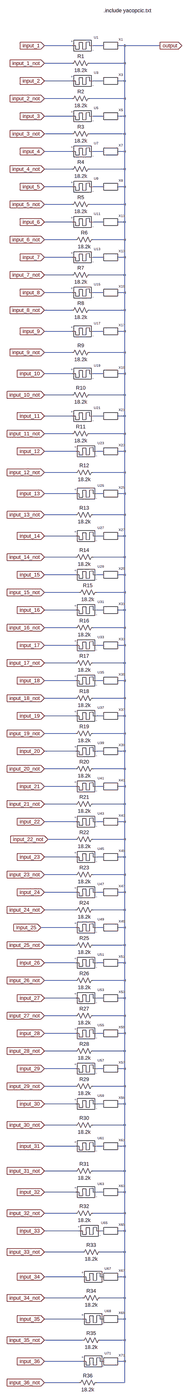
[diagram p0: schematic memristor_block.asc, whole sheet]
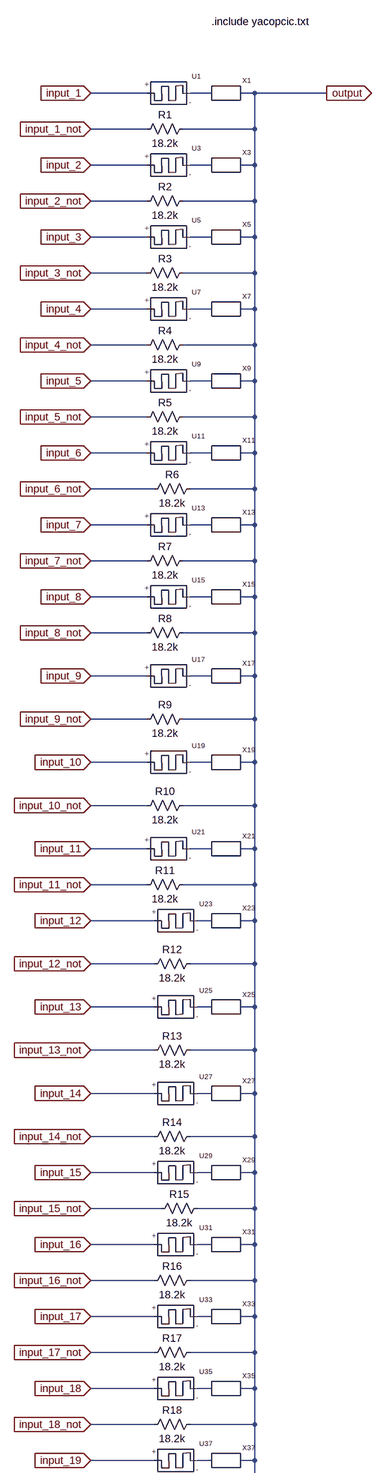
[diagram p1: schematic memristor_block.asc, part, row 1 of 2, column 1 of 1]
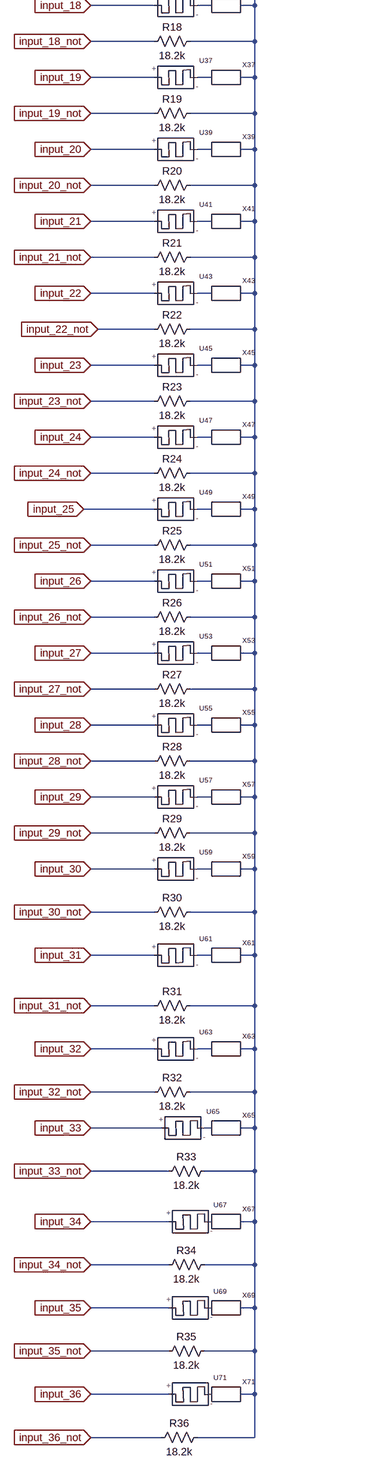
[diagram p2: schematic memristor_block.asc, part, row 2 of 2, column 1 of 1]
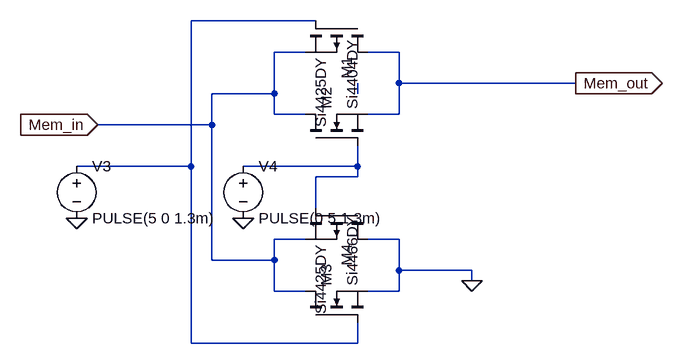
[diagram p3: sub-circuit programmer_with_transmission.asc]
memristor_block.asc, the LTspice schematic file:
Version 4
SHEET 1 880 1512
WIRE -2736 -5216 -2928 -5216
WIRE -2592 -5216 -2640 -5216
WIRE -2496 -5216 -2528 -5216
WIRE -2336 -5216 -2496 -5216
WIRE -2736 -5136 -2928 -5136
WIRE -2496 -5136 -2496 -5216
WIRE -2496 -5136 -2656 -5136
WIRE -2736 -5056 -2928 -5056
WIRE -2592 -5056 -2640 -5056
WIRE -2496 -5056 -2496 -5136
WIRE -2496 -5056 -2528 -5056
WIRE -2736 -4976 -2928 -4976
WIRE -2496 -4976 -2496 -5056
WIRE -2496 -4976 -2656 -4976
WIRE -2736 -4896 -2928 -4896
WIRE -2592 -4896 -2640 -4896
WIRE -2496 -4896 -2496 -4976
WIRE -2496 -4896 -2528 -4896
WIRE -2736 -4816 -2928 -4816
WIRE -2496 -4816 -2496 -4896
WIRE -2496 -4816 -2656 -4816
WIRE -2736 -4736 -2928 -4736
WIRE -2592 -4736 -2640 -4736
WIRE -2496 -4736 -2496 -4816
WIRE -2496 -4736 -2528 -4736
WIRE -2736 -4656 -2928 -4656
WIRE -2496 -4656 -2496 -4736
WIRE -2496 -4656 -2656 -4656
WIRE -2736 -4576 -2928 -4576
WIRE -2592 -4576 -2640 -4576
WIRE -2496 -4576 -2496 -4656
WIRE -2496 -4576 -2528 -4576
WIRE -2736 -4496 -2928 -4496
WIRE -2496 -4496 -2496 -4576
WIRE -2496 -4496 -2656 -4496
WIRE -2736 -4416 -2928 -4416
WIRE -2592 -4416 -2640 -4416
WIRE -2496 -4416 -2496 -4496
WIRE -2496 -4416 -2528 -4416
WIRE -2720 -4336 -2928 -4336
WIRE -2496 -4336 -2496 -4416
WIRE -2496 -4336 -2640 -4336
WIRE -2736 -4256 -2928 -4256
WIRE -2592 -4256 -2640 -4256
WIRE -2496 -4256 -2496 -4336
WIRE -2496 -4256 -2528 -4256
WIRE -2736 -4176 -2928 -4176
WIRE -2496 -4176 -2496 -4256
WIRE -2496 -4176 -2656 -4176
WIRE -2736 -4096 -2928 -4096
WIRE -2592 -4096 -2640 -4096
WIRE -2496 -4096 -2496 -4176
WIRE -2496 -4096 -2528 -4096
WIRE -2736 -4016 -2928 -4016
WIRE -2496 -4016 -2496 -4096
WIRE -2496 -4016 -2656 -4016
WIRE -2736 -3920 -2928 -3920
WIRE -2592 -3920 -2640 -3920
WIRE -2496 -3920 -2496 -4016
WIRE -2496 -3920 -2528 -3920
WIRE -2736 -3824 -2928 -3824
WIRE -2496 -3824 -2496 -3920
WIRE -2496 -3824 -2656 -3824
WIRE -2736 -3728 -2928 -3728
WIRE -2592 -3728 -2640 -3728
WIRE -2496 -3728 -2496 -3824
WIRE -2496 -3728 -2528 -3728
WIRE -2736 -3632 -2928 -3632
WIRE -2496 -3632 -2496 -3728
WIRE -2496 -3632 -2656 -3632
WIRE -2736 -3536 -2928 -3536
WIRE -2592 -3536 -2640 -3536
WIRE -2496 -3536 -2496 -3632
WIRE -2496 -3536 -2528 -3536
WIRE -2736 -3456 -2928 -3456
WIRE -2496 -3456 -2496 -3536
WIRE -2496 -3456 -2656 -3456
WIRE -2720 -3376 -2928 -3376
WIRE -2592 -3376 -2624 -3376
WIRE -2496 -3376 -2496 -3456
WIRE -2496 -3376 -2528 -3376
WIRE -2720 -3280 -2928 -3280
WIRE -2496 -3280 -2496 -3376
WIRE -2496 -3280 -2640 -3280
WIRE -2720 -3184 -2928 -3184
WIRE -2592 -3184 -2624 -3184
WIRE -2496 -3184 -2496 -3280
WIRE -2496 -3184 -2528 -3184
WIRE -2720 -3088 -2928 -3088
WIRE -2496 -3088 -2496 -3184
WIRE -2496 -3088 -2640 -3088
WIRE -2720 -2992 -2928 -2992
WIRE -2592 -2992 -2624 -2992
WIRE -2496 -2992 -2496 -3088
WIRE -2496 -2992 -2528 -2992
WIRE -2720 -2896 -2928 -2896
WIRE -2496 -2896 -2496 -2992
WIRE -2496 -2896 -2640 -2896
WIRE -2720 -2816 -2928 -2816
WIRE -2592 -2816 -2624 -2816
WIRE -2496 -2816 -2496 -2896
WIRE -2496 -2816 -2528 -2816
WIRE -2704 -2736 -2928 -2736
WIRE -2496 -2736 -2496 -2816
WIRE -2496 -2736 -2624 -2736
WIRE -2720 -2656 -2928 -2656
WIRE -2592 -2656 -2624 -2656
WIRE -2496 -2656 -2496 -2736
WIRE -2496 -2656 -2528 -2656
WIRE -2720 -2576 -2928 -2576
WIRE -2496 -2576 -2496 -2656
WIRE -2496 -2576 -2640 -2576
WIRE -2720 -2496 -2928 -2496
WIRE -2592 -2496 -2624 -2496
WIRE -2496 -2496 -2496 -2576
WIRE -2496 -2496 -2528 -2496
WIRE -2720 -2416 -2928 -2416
WIRE -2496 -2416 -2496 -2496
WIRE -2496 -2416 -2640 -2416
WIRE -2720 -2336 -2928 -2336
WIRE -2592 -2336 -2624 -2336
WIRE -2496 -2336 -2496 -2416
WIRE -2496 -2336 -2528 -2336
WIRE -2720 -2256 -2928 -2256
WIRE -2496 -2256 -2496 -2336
WIRE -2496 -2256 -2640 -2256
WIRE -2720 -2176 -2928 -2176
WIRE -2592 -2176 -2624 -2176
WIRE -2496 -2176 -2496 -2256
WIRE -2496 -2176 -2528 -2176
WIRE -2720 -2096 -2928 -2096
WIRE -2496 -2096 -2496 -2176
WIRE -2496 -2096 -2640 -2096
WIRE -2720 -2016 -2928 -2016
WIRE -2592 -2016 -2624 -2016
WIRE -2496 -2016 -2496 -2096
WIRE -2496 -2016 -2528 -2016
WIRE -2720 -1936 -2928 -1936
WIRE -2496 -1936 -2496 -2016
WIRE -2496 -1936 -2640 -1936
WIRE -2720 -1856 -2928 -1856
WIRE -2592 -1856 -2624 -1856
WIRE -2496 -1856 -2496 -1936
WIRE -2496 -1856 -2528 -1856
WIRE -2720 -1776 -2928 -1776
WIRE -2496 -1776 -2496 -1856
WIRE -2496 -1776 -2640 -1776
WIRE -2720 -1696 -2928 -1696
WIRE -2592 -1696 -2624 -1696
WIRE -2496 -1696 -2496 -1776
WIRE -2496 -1696 -2528 -1696
WIRE -2720 -1616 -2912 -1616
WIRE -2496 -1616 -2496 -1696
WIRE -2496 -1616 -2640 -1616
WIRE -2720 -1536 -2928 -1536
WIRE -2592 -1536 -2624 -1536
WIRE -2496 -1536 -2496 -1616
WIRE -2496 -1536 -2528 -1536
WIRE -2720 -1456 -2928 -1456
WIRE -2496 -1456 -2496 -1536
WIRE -2496 -1456 -2640 -1456
WIRE -2720 -1376 -2928 -1376
WIRE -2592 -1376 -2624 -1376
WIRE -2496 -1376 -2496 -1456
WIRE -2496 -1376 -2528 -1376
WIRE -2720 -1296 -2928 -1296
WIRE -2496 -1296 -2496 -1376
WIRE -2496 -1296 -2640 -1296
WIRE -2720 -1216 -2944 -1216
WIRE -2592 -1216 -2624 -1216
WIRE -2496 -1216 -2496 -1296
WIRE -2496 -1216 -2528 -1216
WIRE -2720 -1136 -2928 -1136
WIRE -2496 -1136 -2496 -1216
WIRE -2496 -1136 -2640 -1136
WIRE -2720 -1056 -2928 -1056
WIRE -2592 -1056 -2624 -1056
WIRE -2496 -1056 -2496 -1136
WIRE -2496 -1056 -2528 -1056
WIRE -2720 -976 -2928 -976
WIRE -2496 -976 -2496 -1056
WIRE -2496 -976 -2640 -976
WIRE -2720 -896 -2928 -896
WIRE -2592 -896 -2624 -896
WIRE -2496 -896 -2496 -976
WIRE -2496 -896 -2528 -896
WIRE -2720 -816 -2928 -816
WIRE -2496 -816 -2496 -896
WIRE -2496 -816 -2640 -816
WIRE -2720 -736 -2928 -736
WIRE -2592 -736 -2624 -736
WIRE -2496 -736 -2496 -816
WIRE -2496 -736 -2528 -736
WIRE -2720 -656 -2928 -656
WIRE -2496 -656 -2496 -736
WIRE -2496 -656 -2640 -656
WIRE -2720 -576 -2928 -576
WIRE -2592 -576 -2624 -576
WIRE -2496 -576 -2496 -656
WIRE -2496 -576 -2528 -576
WIRE -2720 -496 -2928 -496
WIRE -2496 -496 -2496 -576
WIRE -2496 -496 -2640 -496
WIRE -2720 -416 -2928 -416
WIRE -2592 -416 -2624 -416
WIRE -2496 -416 -2496 -496
WIRE -2496 -416 -2528 -416
WIRE -2720 -320 -2928 -320
WIRE -2496 -320 -2496 -416
WIRE -2496 -320 -2640 -320
WIRE -2720 -224 -2928 -224
WIRE -2592 -224 -2624 -224
WIRE -2496 -224 -2496 -320
WIRE -2496 -224 -2528 -224
WIRE -2720 -112 -2928 -112
WIRE -2496 -112 -2496 -224
WIRE -2496 -112 -2640 -112
WIRE -2720 -16 -2928 -16
WIRE -2592 -16 -2624 -16
WIRE -2496 -16 -2496 -112
WIRE -2496 -16 -2528 -16
WIRE -2720 80 -2928 80
WIRE -2496 80 -2496 -16
WIRE -2496 80 -2640 80
WIRE -2704 160 -2928 160
WIRE -2592 160 -2608 160
WIRE -2496 160 -2496 80
WIRE -2496 160 -2528 160
WIRE -2688 256 -2928 256
WIRE -2496 256 -2496 160
WIRE -2496 256 -2608 256
WIRE -2688 368 -2928 368
WIRE -2496 368 -2496 256
WIRE -2496 368 -2528 368
WIRE -2688 464 -2928 464
WIRE -2496 464 -2496 368
WIRE -2496 464 -2608 464
WIRE -2688 560 -2928 560
WIRE -2496 560 -2496 464
WIRE -2496 560 -2528 560
WIRE -2688 656 -2928 656
WIRE -2496 656 -2496 560
WIRE -2496 656 -2608 656
WIRE -2688 752 -2928 752
WIRE -2496 752 -2496 656
WIRE -2496 752 -2528 752
WIRE -2704 848 -2928 848
WIRE -2496 848 -2496 752
WIRE -2496 848 -2624 848
FLAG -2928 -5216 input_1
IOPIN -2928 -5216 In
FLAG -2928 -5136 input_1_not
IOPIN -2928 -5136 In
FLAG -2928 -5056 input_2
IOPIN -2928 -5056 In
FLAG -2928 -4976 input_2_not
IOPIN -2928 -4976 In
FLAG -2928 -4896 input_3
IOPIN -2928 -4896 In
FLAG -2928 -4816 input_3_not
IOPIN -2928 -4816 In
FLAG -2928 -4736 input_4
IOPIN -2928 -4736 In
FLAG -2928 -4656 input_4_not
IOPIN -2928 -4656 In
FLAG -2928 -4576 input_5
IOPIN -2928 -4576 In
FLAG -2928 -4496 input_5_not
IOPIN -2928 -4496 In
FLAG -2928 -4416 input_6
IOPIN -2928 -4416 In
FLAG -2928 -4336 input_6_not
IOPIN -2928 -4336 In
FLAG -2928 -4256 input_7
IOPIN -2928 -4256 In
FLAG -2928 -4176 input_7_not
IOPIN -2928 -4176 In
FLAG -2928 -4096 input_8
IOPIN -2928 -4096 In
FLAG -2928 -4016 input_8_not
IOPIN -2928 -4016 In
FLAG -2336 -5216 output
IOPIN -2336 -5216 Out
FLAG -2928 -3920 input_9
IOPIN -2928 -3920 In
FLAG -2928 -3824 input_9_not
IOPIN -2928 -3824 In
FLAG -2928 -3728 input_10
IOPIN -2928 -3728 In
FLAG -2928 -3632 input_10_not
IOPIN -2928 -3632 In
FLAG -2928 -3536 input_11
IOPIN -2928 -3536 In
FLAG -2928 -3456 input_11_not
IOPIN -2928 -3456 In
FLAG -2928 -3376 input_12
IOPIN -2928 -3376 In
FLAG -2928 -3280 input_12_not
IOPIN -2928 -3280 In
FLAG -2928 -3184 input_13
IOPIN -2928 -3184 In
FLAG -2928 -3088 input_13_not
IOPIN -2928 -3088 In
FLAG -2928 -2992 input_14
IOPIN -2928 -2992 In
FLAG -2928 -2896 input_14_not
IOPIN -2928 -2896 In
FLAG -2928 -2816 input_15
IOPIN -2928 -2816 In
FLAG -2928 -2736 input_15_not
IOPIN -2928 -2736 In
FLAG -2928 -2656 input_16
IOPIN -2928 -2656 In
FLAG -2928 -2576 input_16_not
IOPIN -2928 -2576 In
FLAG -2928 -2496 input_17
IOPIN -2928 -2496 In
FLAG -2928 -2416 input_17_not
IOPIN -2928 -2416 In
FLAG -2928 -2336 input_18
IOPIN -2928 -2336 In
FLAG -2928 -2256 input_18_not
IOPIN -2928 -2256 In
FLAG -2928 -2176 input_19
IOPIN -2928 -2176 In
FLAG -2928 -2096 input_19_not
IOPIN -2928 -2096 In
FLAG -2928 -2016 input_20
IOPIN -2928 -2016 In
FLAG -2928 -1936 input_20_not
IOPIN -2928 -1936 In
FLAG -2928 -1856 input_21
IOPIN -2928 -1856 In
FLAG -2928 -1776 input_21_not
IOPIN -2928 -1776 In
FLAG -2928 -1696 input_22
IOPIN -2928 -1696 In
FLAG -2912 -1616 input_22_not
IOPIN -2912 -1616 In
FLAG -2928 -1536 input_23
IOPIN -2928 -1536 In
FLAG -2928 -1456 input_23_not
IOPIN -2928 -1456 In
FLAG -2928 -1376 input_24
IOPIN -2928 -1376 In
FLAG -2928 -1296 input_24_not
IOPIN -2928 -1296 In
FLAG -2944 -1216 input_25
IOPIN -2944 -1216 In
FLAG -2928 -1136 input_25_not
IOPIN -2928 -1136 In
FLAG -2928 -1056 input_26
IOPIN -2928 -1056 In
FLAG -2928 -976 input_26_not
IOPIN -2928 -976 In
FLAG -2928 -896 input_27
IOPIN -2928 -896 In
FLAG -2928 -816 input_27_not
IOPIN -2928 -816 In
FLAG -2928 -736 input_28
IOPIN -2928 -736 In
FLAG -2928 -656 input_28_not
IOPIN -2928 -656 In
FLAG -2928 -576 input_29
IOPIN -2928 -576 In
FLAG -2928 -496 input_29_not
IOPIN -2928 -496 In
FLAG -2928 -416 input_30
IOPIN -2928 -416 In
FLAG -2928 -320 input_30_not
IOPIN -2928 -320 In
FLAG -2928 -224 input_31
IOPIN -2928 -224 In
FLAG -2928 -112 input_31_not
IOPIN -2928 -112 In
FLAG -2928 -16 input_32
IOPIN -2928 -16 In
FLAG -2928 80 input_32_not
IOPIN -2928 80 In
FLAG -2928 160 input_33
IOPIN -2928 160 In
FLAG -2928 256 input_33_not
IOPIN -2928 256 In
FLAG -2928 368 input_34
IOPIN -2928 368 In
FLAG -2928 464 input_34_not
IOPIN -2928 464 In
FLAG -2928 560 input_35
IOPIN -2928 560 In
FLAG -2928 656 input_35_not
IOPIN -2928 656 In
FLAG -2928 752 input_36
IOPIN -2928 752 In
FLAG -2928 848 input_36_not
IOPIN -2928 848 In
SYMBOL memristormodel -2656 -5216 R0
SYMATTR InstName U1
SYMATTR Value MEM_YAKOPCIC
SYMBOL programmer_with_transmission -2528 -5184 R0
SYMATTR InstName X1
SYMBOL memristormodel -2656 -5056 R0
SYMATTR InstName U3
SYMATTR Value MEM_YAKOPCIC
SYMBOL memristormodel -2656 -4896 R0
SYMATTR InstName U5
SYMATTR Value MEM_YAKOPCIC
SYMBOL memristormodel -2656 -4736 R0
SYMATTR InstName U7
SYMATTR Value MEM_YAKOPCIC
SYMBOL memristormodel -2656 -4576 R0
SYMATTR InstName U9
SYMATTR Value MEM_YAKOPCIC
SYMBOL memristormodel -2656 -4416 R0
SYMATTR InstName U11
SYMATTR Value MEM_YAKOPCIC
SYMBOL memristormodel -2656 -4256 R0
SYMATTR InstName U13
SYMATTR Value MEM_YAKOPCIC
SYMBOL memristormodel -2656 -4096 R0
SYMATTR InstName U15
SYMATTR Value MEM_YAKOPCIC
SYMBOL programmer_with_transmission -2528 -5024 R0
SYMATTR InstName X3
SYMBOL programmer_with_transmission -2528 -4864 R0
SYMATTR InstName X5
SYMBOL programmer_with_transmission -2528 -4704 R0
SYMATTR InstName X7
SYMBOL programmer_with_transmission -2528 -4544 R0
SYMATTR InstName X9
SYMBOL programmer_with_transmission -2528 -4384 R0
SYMATTR InstName X11
SYMBOL programmer_with_transmission -2528 -4224 R0
SYMATTR InstName X13
SYMBOL programmer_with_transmission -2528 -4064 R0
SYMATTR InstName X15
SYMBOL memristormodel -2656 -3920 R0
SYMATTR InstName U17
SYMATTR Value MEM_YAKOPCIC
SYMBOL memristormodel -2656 -3728 R0
SYMATTR InstName U19
SYMATTR Value MEM_YAKOPCIC
SYMBOL memristormodel -2656 -3536 R0
SYMATTR InstName U21
SYMATTR Value MEM_YAKOPCIC
SYMBOL memristormodel -2640 -3376 R0
SYMATTR InstName U23
SYMATTR Value MEM_YAKOPCIC
SYMBOL memristormodel -2640 -3184 R0
SYMATTR InstName U25
SYMATTR Value MEM_YAKOPCIC
SYMBOL memristormodel -2640 -2992 R0
SYMATTR InstName U27
SYMATTR Value MEM_YAKOPCIC
SYMBOL memristormodel -2640 -2816 R0
SYMATTR InstName U29
SYMATTR Value MEM_YAKOPCIC
SYMBOL memristormodel -2640 -2656 R0
SYMATTR InstName U31
SYMATTR Value MEM_YAKOPCIC
SYMBOL memristormodel -2640 -2496 R0
SYMATTR InstName U33
SYMATTR Value MEM_YAKOPCIC
SYMBOL memristormodel -2640 -2336 R0
SYMATTR InstName U35
SYMATTR Value MEM_YAKOPCIC
SYMBOL programmer_with_transmission -2528 -3888 R0
SYMATTR InstName X17
SYMBOL programmer_with_transmission -2528 -3696 R0
SYMATTR InstName X19
SYMBOL programmer_with_transmission -2528 -3504 R0
SYMATTR InstName X21
SYMBOL programmer_with_transmission -2528 -3344 R0
SYMATTR InstName X23
SYMBOL programmer_with_transmission -2528 -3152 R0
SYMATTR InstName X25
SYMBOL programmer_with_transmission -2528 -2960 R0
SYMATTR InstName X27
SYMBOL programmer_with_transmission -2528 -2784 R0
SYMATTR InstName X29
SYMBOL programmer_with_transmission -2528 -2624 R0
SYMATTR InstName X31
SYMBOL programmer_with_transmission -2528 -2464 R0
SYMATTR InstName X33
SYMBOL programmer_with_transmission -2528 -2304 R0
SYMATTR InstName X35
SYMBOL memristormodel -2640 -2176 R0
SYMATTR InstName U37
SYMATTR Value MEM_YAKOPCIC
SYMBOL memristormodel -2640 -2016 R0
SYMATTR InstName U39
SYMATTR Value MEM_YAKOPCIC
SYMBOL memristormodel -2640 -1856 R0
SYMATTR InstName U41
SYMATTR Value MEM_YAKOPCIC
SYMBOL memristormodel -2640 -1696 R0
SYMATTR InstName U43
SYMATTR Value MEM_YAKOPCIC
SYMBOL memristormodel -2640 -1536 R0
SYMATTR InstName U45
SYMATTR Value MEM_YAKOPCIC
SYMBOL memristormodel -2640 -1376 R0
SYMATTR InstName U47
SYMATTR Value MEM_YAKOPCIC
SYMBOL memristormodel -2640 -1216 R0
SYMATTR InstName U49
SYMATTR Value MEM_YAKOPCIC
SYMBOL memristormodel -2640 -1056 R0
SYMATTR InstName U51
SYMATTR Value MEM_YAKOPCIC
SYMBOL memristormodel -2640 -896 R0
SYMATTR InstName U53
SYMATTR Value MEM_YAKOPCIC
SYMBOL memristormodel -2640 -736 R0
SYMATTR InstName U55
SYMATTR Value MEM_YAKOPCIC
SYMBOL memristormodel -2640 -576 R0
SYMATTR InstName U57
SYMATTR Value MEM_YAKOPCIC
SYMBOL memristormodel -2640 -416 R0
SYMATTR InstName U59
SYMATTR Value MEM_YAKOPCIC
SYMBOL memristormodel -2640 -224 R0
SYMATTR InstName U61
SYMATTR Value MEM_YAKOPCIC
SYMBOL memristormodel -2640 -16 R0
SYMATTR InstName U63
SYMATTR Value MEM_YAKOPCIC
SYMBOL memristormodel -2624 160 R0
SYMATTR InstName U65
SYMATTR Value MEM_YAKOPCIC
SYMBOL memristormodel -2608 368 R0
SYMATTR InstName U67
SYMATTR Value MEM_YAKOPCIC
SYMBOL memristormodel -2608 560 R0
SYMATTR InstName U69
SYMATTR Value MEM_YAKOPCIC
SYMBOL memristormodel -2608 752 R0
SYMATTR InstName U71
SYMATTR Value MEM_YAKOPCIC
SYMBOL programmer_with_transmission -2528 -2144 R0
SYMATTR InstName X37
SYMBOL programmer_with_transmission -2528 -1984 R0
SYMATTR InstName X39
SYMBOL programmer_with_transmission -2528 -1824 R0
SYMATTR InstName X41
SYMBOL programmer_with_transmission -2528 -1664 R0
SYMATTR InstName X43
SYMBOL programmer_with_transmission -2528 -1504 R0
SYMATTR InstName X45
SYMBOL programmer_with_transmission -2528 -1344 R0
SYMATTR InstName X47
SYMBOL programmer_with_transmission -2528 -1184 R0
SYMATTR InstName X49
SYMBOL programmer_with_transmission -2528 -1024 R0
SYMATTR InstName X51
SYMBOL programmer_with_transmission -2528 -864 R0
SYMATTR InstName X53
SYMBOL programmer_with_transmission -2528 -704 R0
SYMATTR InstName X55
SYMBOL programmer_with_transmission -2528 -544 R0
SYMATTR InstName X57
SYMBOL programmer_with_transmission -2528 -384 R0
SYMATTR InstName X59
SYMBOL programmer_with_transmission -2528 -192 R0
SYMATTR InstName X61
SYMBOL programmer_with_transmission -2528 16 R0
SYMATTR InstName X63
SYMBOL programmer_with_transmission -2528 192 R0
SYMATTR InstName X65
SYMBOL programmer_with_transmission -2528 400 R0
SYMATTR InstName X67
SYMBOL programmer_with_transmission -2528 592 R0
SYMATTR InstName X69
SYMBOL programmer_with_transmission -2528 784 R0
SYMATTR InstName X71
SYMBOL res -2640 -5152 R90
WINDOW 0 0 56 VBottom 2
WINDOW 3 32 56 VTop 2
SYMATTR InstName R1
SYMATTR Value 18.2k
SYMBOL res -2640 -4992 R90
WINDOW 0 0 56 VBottom 2
WINDOW 3 32 56 VTop 2
SYMATTR InstName R2
SYMATTR Value 18.2k
SYMBOL res -2640 -4832 R90
WINDOW 0 0 56 VBottom 2
WINDOW 3 32 56 VTop 2
SYMATTR InstName R3
SYMATTR Value 18.2k
SYMBOL res -2640 -4672 R90
WINDOW 0 0 56 VBottom 2
WINDOW 3 32 56 VTop 2
SYMATTR InstName R4
SYMATTR Value 18.2k
SYMBOL res -2640 -4512 R90
WINDOW 0 0 56 VBottom 2
WINDOW 3 32 56 VTop 2
SYMATTR InstName R5
SYMATTR Value 18.2k
SYMBOL res -2624 -4352 R90
WINDOW 0 0 56 VBottom 2
WINDOW 3 32 56 VTop 2
SYMATTR InstName R6
SYMATTR Value 18.2k
SYMBOL res -2640 -4192 R90
WINDOW 0 0 56 VBottom 2
WINDOW 3 32 56 VTop 2
SYMATTR InstName R7
SYMATTR Value 18.2k
SYMBOL res -2640 -4032 R90
WINDOW 0 0 56 VBottom 2
WINDOW 3 32 56 VTop 2
SYMATTR InstName R8
SYMATTR Value 18.2k
SYMBOL res -2640 -3840 R90
WINDOW 0 0 56 VBottom 2
WINDOW 3 32 56 VTop 2
SYMATTR InstName R9
SYMATTR Value 18.2k
SYMBOL res -2640 -3648 R90
WINDOW 0 0 56 VBottom 2
WINDOW 3 32 56 VTop 2
SYMATTR InstName R10
SYMATTR Value 18.2k
SYMBOL res -2640 -3472 R90
WINDOW 0 0 56 VBottom 2
WINDOW 3 32 56 VTop 2
SYMATTR InstName R11
SYMATTR Value 18.2k
SYMBOL res -2624 -3296 R90
WINDOW 0 0 56 VBottom 2
WINDOW 3 32 56 VTop 2
SYMATTR InstName R12
SYMATTR Value 18.2k
SYMBOL res -2624 -3104 R90
WINDOW 0 0 56 VBottom 2
WINDOW 3 32 56 VTop 2
SYMATTR InstName R13
SYMATTR Value 18.2k
SYMBOL res -2624 -2912 R90
WINDOW 0 0 56 VBottom 2
WINDOW 3 32 56 VTop 2
SYMATTR InstName R14
SYMATTR Value 18.2k
SYMBOL res -2608 -2752 R90
WINDOW 0 0 56 VBottom 2
WINDOW 3 32 56 VTop 2
SYMATTR InstName R15
SYMATTR Value 18.2k
SYMBOL res -2624 -2592 R90
WINDOW 0 0 56 VBottom 2
WINDOW 3 32 56 VTop 2
SYMATTR InstName R16
SYMATTR Value 18.2k
SYMBOL res -2624 -2432 R90
WINDOW 0 0 56 VBottom 2
WINDOW 3 32 56 VTop 2
SYMATTR InstName R17
SYMATTR Value 18.2k
SYMBOL res -2624 -2272 R90
WINDOW 0 0 56 VBottom 2
WINDOW 3 32 56 VTop 2
SYMATTR InstName R18
SYMATTR Value 18.2k
SYMBOL res -2624 -2112 R90
WINDOW 0 0 56 VBottom 2
WINDOW 3 32 56 VTop 2
SYMATTR InstName R19
SYMATTR Value 18.2k
SYMBOL res -2624 -1952 R90
WINDOW 0 0 56 VBottom 2
WINDOW 3 32 56 VTop 2
SYMATTR InstName R20
SYMATTR Value 18.2k
SYMBOL res -2624 -1792 R90
WINDOW 0 0 56 VBottom 2
WINDOW 3 32 56 VTop 2
SYMATTR InstName R21
SYMATTR Value 18.2k
SYMBOL res -2624 -1632 R90
WINDOW 0 0 56 VBottom 2
WINDOW 3 32 56 VTop 2
SYMATTR InstName R22
SYMATTR Value 18.2k
SYMBOL res -2624 -1472 R90
WINDOW 0 0 56 VBottom 2
WINDOW 3 32 56 VTop 2
SYMATTR InstName R23
SYMATTR Value 18.2k
SYMBOL res -2624 -1312 R90
WINDOW 0 0 56 VBottom 2
WINDOW 3 32 56 VTop 2
SYMATTR InstName R24
SYMATTR Value 18.2k
SYMBOL res -2624 -1152 R90
WINDOW 0 0 56 VBottom 2
WINDOW 3 32 56 VTop 2
SYMATTR InstName R25
SYMATTR Value 18.2k
SYMBOL res -2624 -992 R90
WINDOW 0 0 56 VBottom 2
WINDOW 3 32 56 VTop 2
SYMATTR InstName R26
SYMATTR Value 18.2k
SYMBOL res -2624 -832 R90
WINDOW 0 0 56 VBottom 2
WINDOW 3 32 56 VTop 2
SYMATTR InstName R27
SYMATTR Value 18.2k
SYMBOL res -2624 -672 R90
WINDOW 0 0 56 VBottom 2
WINDOW 3 32 56 VTop 2
SYMATTR InstName R28
SYMATTR Value 18.2k
SYMBOL res -2624 -512 R90
WINDOW 0 0 56 VBottom 2
WINDOW 3 32 56 VTop 2
SYMATTR InstName R29
SYMATTR Value 18.2k
SYMBOL res -2624 -336 R90
WINDOW 0 0 56 VBottom 2
WINDOW 3 32 56 VTop 2
SYMATTR InstName R30
SYMATTR Value 18.2k
SYMBOL res -2624 -128 R90
WINDOW 0 0 56 VBottom 2
WINDOW 3 32 56 VTop 2
SYMATTR InstName R31
SYMATTR Value 18.2k
SYMBOL res -2624 64 R90
WINDOW 0 0 56 VBottom 2
WINDOW 3 32 56 VTop 2
SYMATTR InstName R32
SYMATTR Value 18.2k
SYMBOL res -2592 240 R90
WINDOW 0 0 56 VBottom 2
WINDOW 3 32 56 VTop 2
SYMATTR InstName R33
SYMATTR Value 18.2k
SYMBOL res -2592 448 R90
WINDOW 0 0 56 VBottom 2
WINDOW 3 32 56 VTop 2
SYMATTR InstName R34
SYMATTR Value 18.2k
SYMBOL res -2592 640 R90
WINDOW 0 0 56 VBottom 2
WINDOW 3 32 56 VTop 2
SYMATTR InstName R35
SYMATTR Value 18.2k
SYMBOL res -2608 832 R90
WINDOW 0 0 56 VBottom 2
WINDOW 3 32 56 VTop 2
SYMATTR InstName R36
SYMATTR Value 18.2k
TEXT -2592 -5392 Left 2 !.include yacopcic.txt

programmer_with_transmission.asc, the sub-circuit schematic file:
Version 4
SHEET 1 3176 2536
WIRE 1472 1120 1280 1120
WIRE 1456 1168 1408 1168
WIRE 1600 1168 1552 1168
WIRE 1600 1216 1600 1168
WIRE 1872 1216 1600 1216
WIRE 1408 1232 1408 1168
WIRE 1408 1232 1312 1232
WIRE 1536 1232 1536 1216
WIRE 1408 1264 1408 1232
WIRE 1456 1264 1408 1264
WIRE 1600 1264 1600 1216
WIRE 1600 1264 1552 1264
WIRE 1312 1280 1312 1232
WIRE 1312 1280 1136 1280
WIRE 1280 1344 1280 1120
WIRE 1280 1344 1104 1344
WIRE 1536 1344 1536 1312
WIRE 1536 1344 1360 1344
WIRE 1536 1360 1536 1344
WIRE 1536 1360 1472 1360
WIRE 1472 1408 1472 1360
WIRE 1456 1456 1408 1456
WIRE 1600 1456 1552 1456
WIRE 1312 1488 1312 1280
WIRE 1408 1488 1408 1456
WIRE 1408 1488 1312 1488
WIRE 1600 1504 1600 1456
WIRE 1712 1504 1600 1504
WIRE 1712 1520 1712 1504
WIRE 1408 1536 1408 1488
WIRE 1456 1536 1408 1536
WIRE 1600 1536 1600 1504
WIRE 1600 1536 1552 1536
WIRE 1280 1616 1280 1344
WIRE 1536 1616 1536 1584
WIRE 1536 1616 1280 1616
FLAG 1712 1520 0
FLAG 1104 1424 0
FLAG 1360 1424 0
FLAG 1136 1280 Mem_in
IOPIN 1136 1280 In
FLAG 1872 1216 Mem_out
IOPIN 1872 1216 Out
SYMBOL nmos 1456 1312 R270
SYMATTR InstName M2
SYMATTR Value Si4404DY
SYMBOL nmos 1456 1584 R270
SYMATTR InstName M3
SYMATTR Value Si4466DY
SYMBOL voltage 1104 1328 R0
WINDOW 123 0 0 Left 2
WINDOW 39 0 0 Left 2
SYMATTR InstName V3
SYMATTR Value PULSE(5 0 1.3m)
SYMBOL voltage 1360 1328 R0
WINDOW 123 0 0 Left 2
WINDOW 39 0 0 Left 2
SYMATTR InstName V4
SYMATTR Value PULSE(0 5 1.3m)
SYMBOL pmos 1552 1120 R90
SYMATTR InstName M1
SYMATTR Value Si4425DY
SYMBOL pmos 1552 1408 R90
SYMATTR InstName M4
SYMATTR Value Si4425DY

The netlist it stands for:
* memristor_block.asc
XU1 input_1 N001 M MEM_YAKOPCIC  ; pins + -
XX1 N001 output programmer_with_transmission
XU3 input_2 N002 M MEM_YAKOPCIC  ; pins + -
XU5 input_3 N003 M MEM_YAKOPCIC  ; pins + -
XU7 input_4 N004 M MEM_YAKOPCIC  ; pins + -
XU9 input_5 N005 M MEM_YAKOPCIC  ; pins + -
XU11 input_6 N006 M MEM_YAKOPCIC  ; pins + -
XU13 input_7 N007 M MEM_YAKOPCIC  ; pins + -
XU15 input_8 N008 M MEM_YAKOPCIC  ; pins + -
XX3 N002 output programmer_with_transmission
XX5 N003 output programmer_with_transmission
XX7 N004 output programmer_with_transmission
XX9 N005 output programmer_with_transmission
XX11 N006 output programmer_with_transmission
XX13 N007 output programmer_with_transmission
XX15 N008 output programmer_with_transmission
XU17 input_9 N009 M MEM_YAKOPCIC  ; pins + -
XU19 input_10 N010 M MEM_YAKOPCIC  ; pins + -
XU21 input_11 N011 M MEM_YAKOPCIC  ; pins + -
XU23 input_12 N012 M MEM_YAKOPCIC  ; pins + -
XU25 input_13 N013 M MEM_YAKOPCIC  ; pins + -
XU27 input_14 N014 M MEM_YAKOPCIC  ; pins + -
XU29 input_15 N015 M MEM_YAKOPCIC  ; pins + -
XU31 input_16 N016 M MEM_YAKOPCIC  ; pins + -
XU33 input_17 N017 M MEM_YAKOPCIC  ; pins + -
XU35 input_18 N018 M MEM_YAKOPCIC  ; pins + -
XX17 N009 output programmer_with_transmission
XX19 N010 output programmer_with_transmission
XX21 N011 output programmer_with_transmission
XX23 N012 output programmer_with_transmission
XX25 N013 output programmer_with_transmission
XX27 N014 output programmer_with_transmission
XX29 N015 output programmer_with_transmission
XX31 N016 output programmer_with_transmission
XX33 N017 output programmer_with_transmission
XX35 N018 output programmer_with_transmission
XU37 input_19 N019 M MEM_YAKOPCIC  ; pins + -
XU39 input_20 N020 M MEM_YAKOPCIC  ; pins + -
XU41 input_21 N021 M MEM_YAKOPCIC  ; pins + -
XU43 input_22 N022 M MEM_YAKOPCIC  ; pins + -
XU45 input_23 N023 M MEM_YAKOPCIC  ; pins + -
XU47 input_24 N024 M MEM_YAKOPCIC  ; pins + -
XU49 input_25 N025 M MEM_YAKOPCIC  ; pins + -
XU51 input_26 N026 M MEM_YAKOPCIC  ; pins + -
XU53 input_27 N027 M MEM_YAKOPCIC  ; pins + -
XU55 input_28 N028 M MEM_YAKOPCIC  ; pins + -
XU57 input_29 N029 M MEM_YAKOPCIC  ; pins + -
XU59 input_30 N030 M MEM_YAKOPCIC  ; pins + -
XU61 input_31 N031 M MEM_YAKOPCIC  ; pins + -
XU63 input_32 N032 M MEM_YAKOPCIC  ; pins + -
XU65 input_33 N033 M MEM_YAKOPCIC  ; pins + -
XU67 input_34 P001 M MEM_YAKOPCIC  ; pins + -
XU69 input_35 P002 M MEM_YAKOPCIC  ; pins + -
XU71 input_36 P003 M MEM_YAKOPCIC  ; pins + -
XX37 N019 output programmer_with_transmission
XX39 N020 output programmer_with_transmission
XX41 N021 output programmer_with_transmission
XX43 N022 output programmer_with_transmission
XX45 N023 output programmer_with_transmission
XX47 N024 output programmer_with_transmission
XX49 N025 output programmer_with_transmission
XX51 N026 output programmer_with_transmission
XX53 N027 output programmer_with_transmission
XX55 N028 output programmer_with_transmission
XX57 N029 output programmer_with_transmission
XX59 N030 output programmer_with_transmission
XX61 N031 output programmer_with_transmission
XX63 N032 output programmer_with_transmission
XX65 N033 output programmer_with_transmission
XX67 P001 output programmer_with_transmission
XX69 P002 output programmer_with_transmission
XX71 P003 output programmer_with_transmission
R1 output input_1_not 18.2k
R2 output input_2_not 18.2k
R3 output input_3_not 18.2k
R4 output input_4_not 18.2k
R5 output input_5_not 18.2k
R6 output input_6_not 18.2k
R7 output input_7_not 18.2k
R8 output input_8_not 18.2k
R9 output input_9_not 18.2k
R10 output input_10_not 18.2k
R11 output input_11_not 18.2k
R12 output input_12_not 18.2k
R13 output input_13_not 18.2k
R14 output input_14_not 18.2k
R15 output input_15_not 18.2k
R16 output input_16_not 18.2k
R17 output input_17_not 18.2k
R18 output input_18_not 18.2k
R19 output input_19_not 18.2k
R20 output input_20_not 18.2k
R21 output input_21_not 18.2k
R22 output input_22_not 18.2k
R23 output input_23_not 18.2k
R24 output input_24_not 18.2k
R25 output input_25_not 18.2k
R26 output input_26_not 18.2k
R27 output input_27_not 18.2k
R28 output input_28_not 18.2k
R29 output input_29_not 18.2k
R30 output input_30_not 18.2k
R31 output input_31_not 18.2k
R32 output input_32_not 18.2k
R33 output input_33_not 18.2k
R34 output input_34_not 18.2k
R35 output input_35_not 18.2k
R36 output input_36_not 18.2k

* block symbol definitions
.subckt programmer_with_transmission Mem_in Mem_out
M2 Mem_in N003 Mem_out Mem_out Si4404DY
M3 Mem_in N001 0 0 Si4466DY
V3 N001 0 PULSE(5 0 1.3m)
V4 N003 0 PULSE(0 5 1.3m)
M1 Mem_out N001 Mem_in Mem_in Si4425DY
M4 0 N003 Mem_in Mem_in Si4425DY
.ends programmer_with_transmission

.model NMOS NMOS
.model PMOS PMOS
.lib standard.mos
.include yacopcic.txt
.backanno
.end